# EAGLE schematic perfboard-max3232 (EAGLE 5.06)
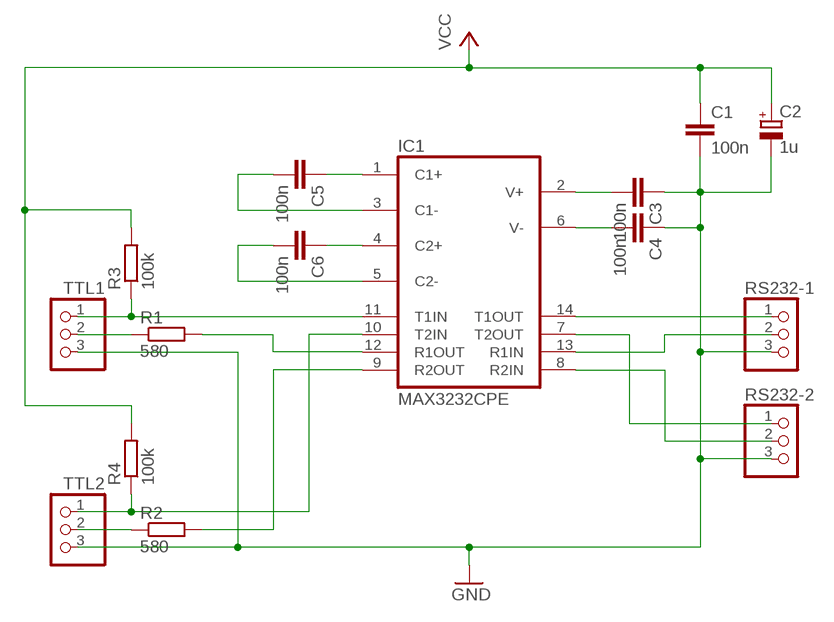
[diagram p0: schematic, sheet 1]

## Parts
C1  100n  C-EU050-024X044  [C050-024X044]
C2  1u  CPOL-EUE1.8-4  [E1,8-4]
C3  100n  C-EU050-024X044  [C050-024X044]
C4  100n  C-EU075-032X103  [C075-032X103]
C5  100n  C-EU050-024X044  [C050-024X044]
C6  100n  C-EU050-024X044  [C050-024X044]
IC1  MAX3232CPE  [DIL16]
R1  580  R-EU_0204/7  [0204/7]
R2  580  R-EU_0204/7  [0204/7]
R3  100k  R-EU_0207/10  [0207/10]
R4  100k  R-EU_0207/10  [0207/10]
RS232-1  PINHD-1X3  [1X03]
RS232-2  PINHD-1X3  [1X03]
TTL1  PINHD-1X3  [1X03]
TTL2  PINHD-1X3  [1X03]

## Nets
C1+: C5.1 IC1.1(C1+)
C1-: C5.2 IC1.3(C1-)
C2+: C6.1 IC1.4(C2+)
C2-: C6.2 IC1.5(C2-)
GND: C1.2 C2.- C3.1 C4.1 RS232-1.3 RS232-2.3 TTL1.3 TTL2.3
N$5: IC1.14(T1OUT) RS232-1.1
N$6: IC1.7(T2OUT) RS232-2.1
N$7: IC1.13(R1IN) RS232-1.2
N$8: IC1.8(R2IN) RS232-2.2
N$9: IC1.11(T1IN) R3.1 TTL1.1
N$10: R1.1 TTL1.2
N$11: R2.1 TTL2.2
N$12: IC1.10(T2IN) R4.1 TTL2.1
N$13: IC1.12(R1OUT) R1.2
N$14: IC1.9(R2OUT) R2.2
V+: C3.2 IC1.2(V+)
V-: C4.2 IC1.6(V-)
VCC: C1.1 C2.+ R3.2 R4.2

## Power pins joined to a net without a drawn wire
GND: IC1.15(GND)
VCC: IC1.16(VCC)

## Library data of the parts
C1 C3-C6 = rcl:C-EU: CAPACITOR, European symbol
C2 = rcl:CPOL-EU: POLARIZED CAPACITOR, European symbol
IC1 = maxim:MAX3232*: True RS-232 Transceivers 3.0V to 5.5V, Low-Power up to 1Mbps, Using Four 0.1µF External Capacitors Source: http://pdfserv.maxim-ic.com/en/ds/MAX3222-MAX3241.pdf
R1-R4 = rcl:R-EU_: RESISTOR, European symbol
RS232-1 RS232-2 TTL1 TTL2 = pinhead:PINHD-1X3: PIN HEADER